# EAGLE design psg-basic (EAGLE 6.6.0)
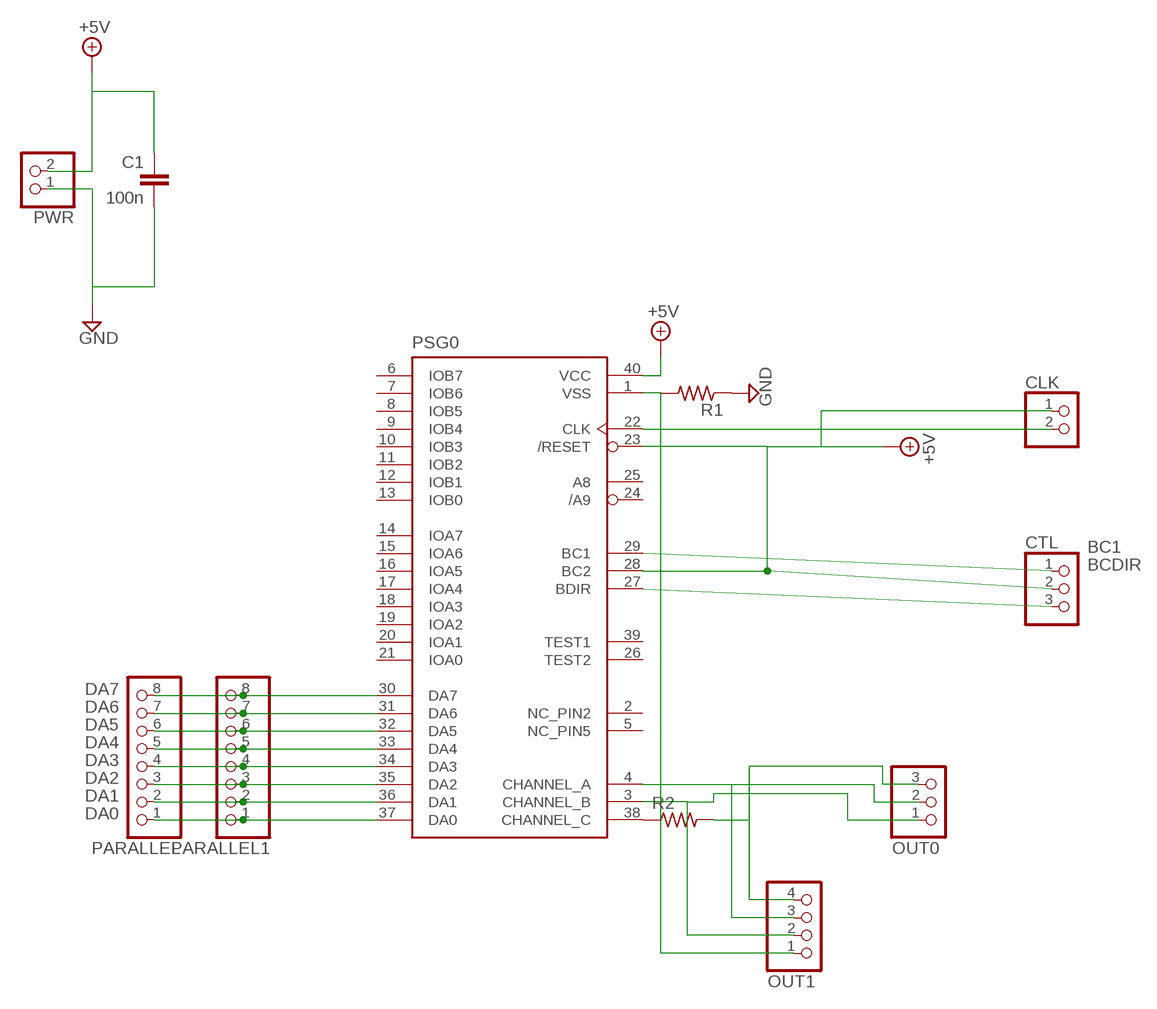
[diagram p0: schematic, sheet 1]

## Parts
C1  100n  050X030_0251  [050X030_025]
CLK  PINHD-1X2  [1X02]
CTL  PINHD-1X3  [1X03]
OUT0  PINHD-1X3  [1X03]
OUT1  PINHD-1X4/90  [1X04/90]
PARALLEL  PINHD-1X8  [1X08]
PARALLEL1  PINHD-1X8  [1X08]
PSG0  AY-3-8910  [DIL40]
PWR  PINHD-1X2  [1X02]
R1  6MM.4.1  [R0207/4A]
R2  6MM.5  [R0207/5]

## Nets
+5V: C1.1 CLK.1 CTL.2 PSG0.23(/RESET) PSG0.28(BC2) PSG0.40(VCC) PWR.2
BC1: CTL.1 PSG0.29(BC1)
BCDIR: CTL.3 PSG0.27(BDIR)
DA0: PARALLEL1.1 PARALLEL.1 PSG0.37(DA0)
DA1: PARALLEL1.2 PARALLEL.2 PSG0.36(DA1)
DA2: PARALLEL1.3 PARALLEL.3 PSG0.35(DA2)
DA3: PARALLEL1.4 PARALLEL.4 PSG0.34(DA3)
DA4: PARALLEL1.5 PARALLEL.5 PSG0.33(DA4)
DA5: PARALLEL1.6 PARALLEL.6 PSG0.32(DA5)
DA6: PARALLEL1.7 PARALLEL.7 PSG0.31(DA6)
DA7: PARALLEL1.8 PARALLEL.8 PSG0.30(DA7)
GND: C1.2 PWR.1 R1.1
N$3: PSG0.38(CHANNEL_C) R2.1
N$4: OUT0.3 OUT1.4 R2.2
N$5: CLK.2 PSG0.22(CLK)
N$6: OUT0.2 OUT1.3 PSG0.4(CHANNEL_A)
N$7: OUT0.1 OUT1.2 PSG0.3(CHANNEL_B)
N$8: OUT1.1 PSG0.1(VSS) R1.2
Unconnected: PSG0.2(NC_PIN2) PSG0.5(NC_PIN5) PSG0.6(IOB7) PSG0.7(IOB6) PSG0.8(IOB5) PSG0.9(IOB4) PSG0.10(IOB3) PSG0.11(IOB2) PSG0.12(IOB1) PSG0.13(IOB0) PSG0.14(IOA7) PSG0.15(IOA6) PSG0.16(IOA5) PSG0.17(IOA4) PSG0.18(IOA3) PSG0.19(IOA2) PSG0.20(IOA1) PSG0.21(IOA0) PSG0.24(/A9) PSG0.25(A8) PSG0.26(TEST2) PSG0.39(TEST1)

## Library data of the parts
C1 = gm-caps-ceramic:050X030_025: 47 - 120pF Xicon Ceramic Disc 2.5mm lead spacing
CLK PWR = pinhead:PINHD-1X2: PIN HEADER
CTL OUT0 = pinhead:PINHD-1X3: PIN HEADER
OUT1 = pinhead:PINHD-1X4: PIN HEADER
PARALLEL PARALLEL1 = pinhead:PINHD-1X8: PIN HEADER
PSG0 = 8Bit_Parts:AY-3-8910
R1 R2 = gm-resistors:6MM: 6mm Resistors Leads spaced 1-6 holes apart for 0.1" perfboard. Suitable for 1/4 watt resistors.

## Board
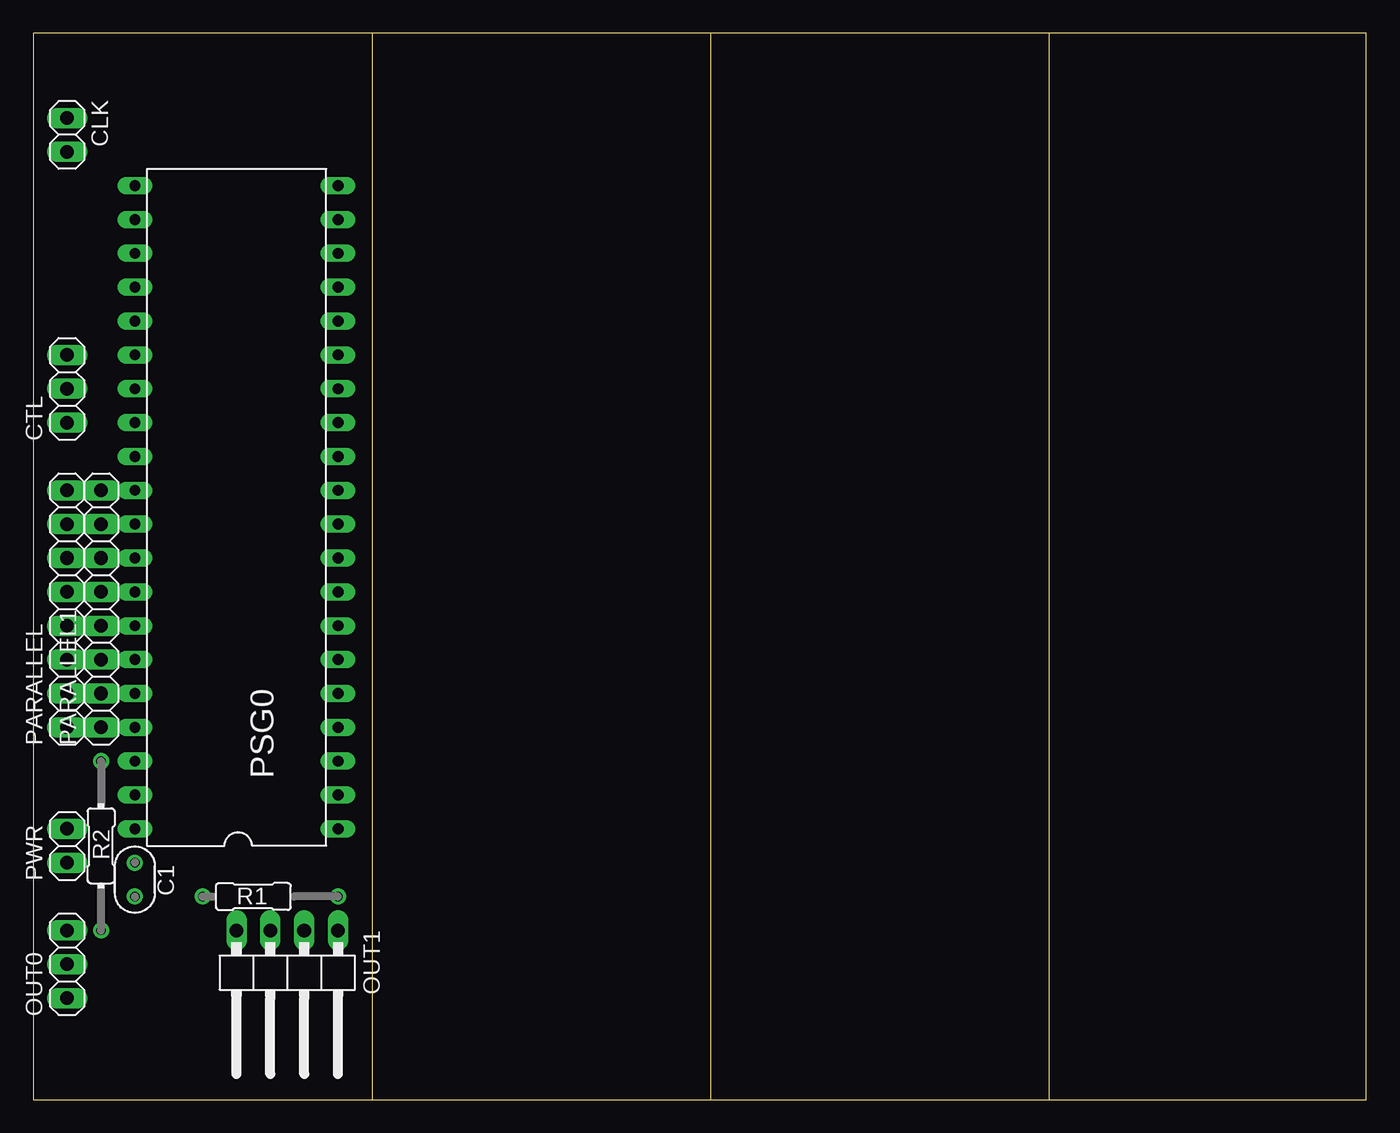
[diagram p1: board, top side]
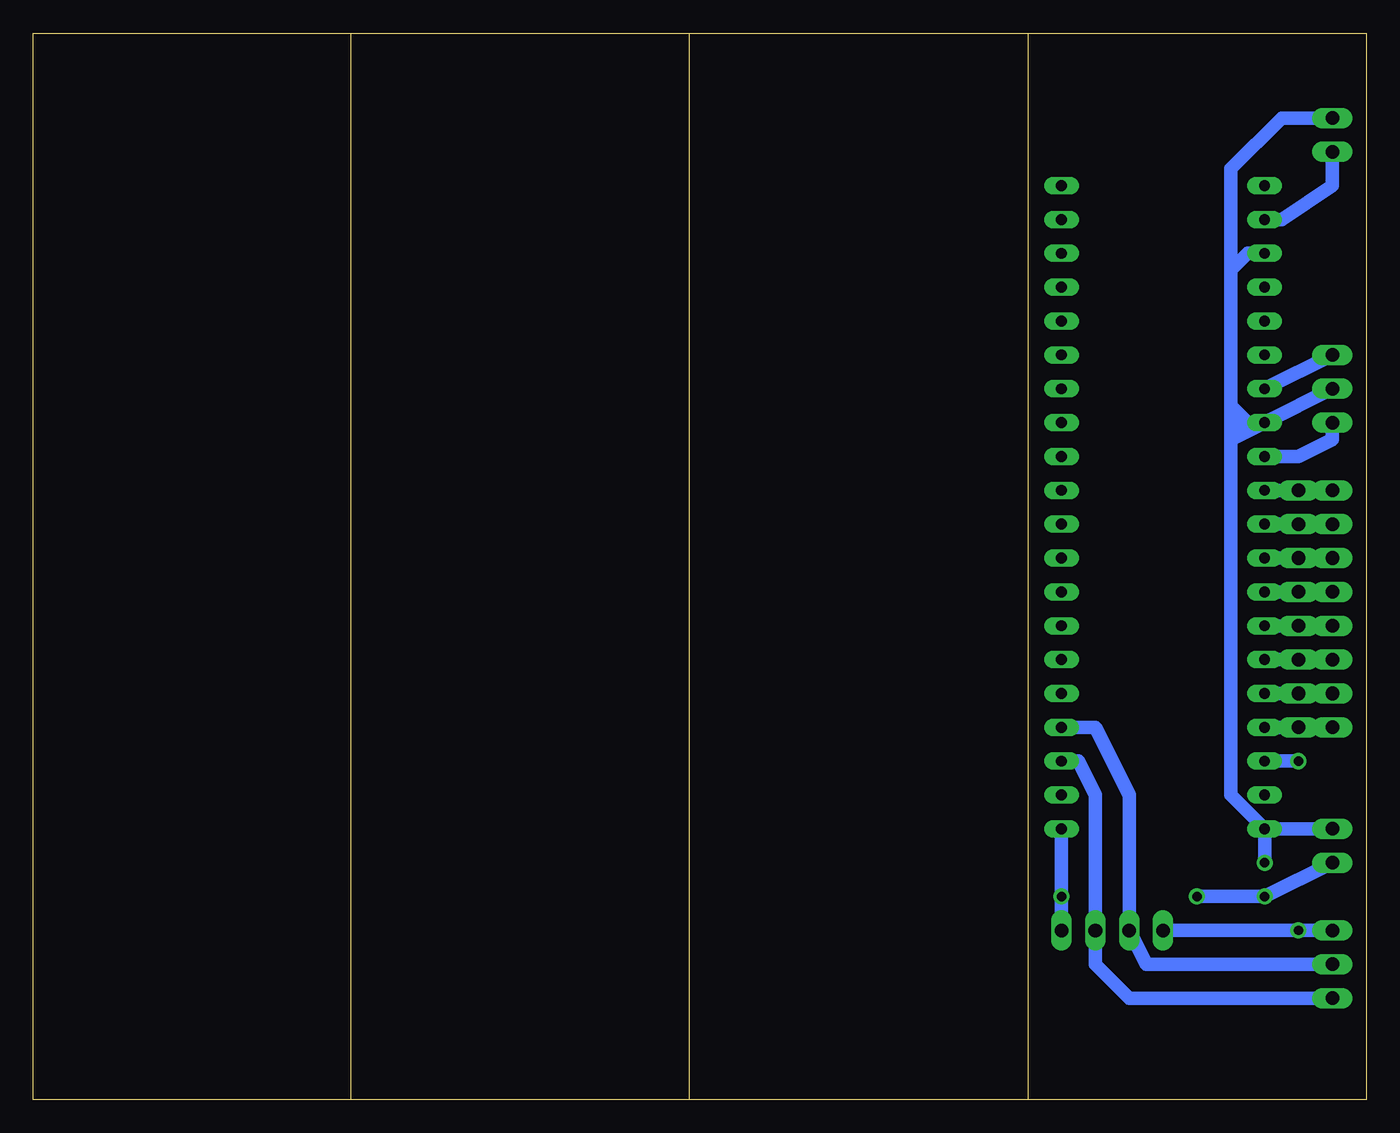
[diagram p2: board, bottom side, seen from below]

Size 100 x 80.01 mm. Coordinates in mm from the lower left corner, seen from the top.
Outline: 25.4,0 0,0 0,80 100,80 100,0 76.2,0
Outline: 25.4,0 50.8,0
Outline: 50.8,0 76.2,0
Outline: 25.4,80.01 25.4,0
Outline: 50.8,80.01 50.8,0
Outline: 76.2,80.01 76.2,0
Copper layers (1*16): Top 0.035mm / dielectric 1.5mm / Bottom 0.035mm
Design rules "default": minimum track width 10mil, minimum drill 24mil, track to track 8mil, track to pad 8mil, pad to pad 8mil, via to via 8mil, smd to smd 8mil, copper to edge 40mil, drill to drill 8mil, minimum pad ring 10mil, minimum via ring 8mil, stop-mask expansion 4mil, vias tented up to drill 0mil, thermal gap 10mil

### Footprints (pad centres in the part's own frame; a part is rotated, then mirrored left to right if it is on the bottom)
050X030_025 = drill 0.7: 1 -1.27,0; 2 1.27,0
1X02 = drill 1.016 long: 1 -1.27,0; 2 1.27,0
1X03 = drill 1.016 long: 1 -2.54,0; 2 0,0; 3 2.54,0
1X04/90 = drill 1.016 long: 1 -3.81,-3.81; 2 -1.27,-3.81; 3 1.27,-3.81; 4 3.81,-3.81
1X08 = drill 1.016 long: 1 -8.89,0; 2 -6.35,0; 3 -3.81,0; 4 -1.27,0; 5 1.27,0; 6 3.81,0; 7 6.35,0; 8 8.89,0
DIL40 = drill 0.813 long: 1 -24.13,-7.62; 2 -21.59,-7.62; 3 -19.05,-7.62; 4 -16.51,-7.62; 5 -13.97,-7.62; 6 -11.43,-7.62; 7 -8.89,-7.62; 8 -6.35,-7.62; 9 -3.81,-7.62; 10 -1.27,-7.62; 11 1.27,-7.62; 12 3.81,-7.62; 13 6.35,-7.62; 14 8.89,-7.62; 15 11.43,-7.62; 16 13.97,-7.62; 17 16.51,-7.62; 18 19.05,-7.62; 19 21.59,-7.62; 20 24.13,-7.62; 21 24.13,7.62; 22 21.59,7.62; 23 19.05,7.62; 24 16.51,7.62; 25 13.97,7.62; 26 11.43,7.62; 27 8.89,7.62; 28 6.35,7.62; 29 3.81,7.62; 30 1.27,7.62; 31 -1.27,7.62; 32 -3.81,7.62; 33 -6.35,7.62; 34 -8.89,7.62; 35 -11.43,7.62; 36 -13.97,7.62; 37 -16.51,7.62; 38 -19.05,7.62; 39 -21.59,7.62; 40 -24.13,7.62
R0207/4A = drill 0.7: 1 -3.81,0; 2 6.35,0
R0207/5 = drill 0.7: 1 -6.35,0; 2 6.35,0

### Placement (x,y rotation side)
C1  7.62,16.51 270 top
CLK  2.54,72.39 270 top
CTL  2.54,53.34 90 top
OUT0  2.54,10.16 90 top
OUT1  19.05,8.89 180 top
PARALLEL  2.54,36.83 90 top
PARALLEL1  5.08,36.83 90 top
PSG0  15.24,44.45 90 top
PWR  2.54,19.05 90 top
R1  16.51,15.24 0 top
R2  5.08,19.05 270 top

### Tracks (layer width: path | path; a pad name or v marks a point on that pad's centre or on a via)
+5V
  Bottom 1.016: 10.16,62.23 10.16,52.07 | 10.16,52.07 8.89,50.8 PSG0.28 | 10.16,52.07 10.16,50.8 | 10.16,49.53 10.16,22.86 PSG0.40 | PWR.2 PSG0.40 | PSG0.40 C1.1 | PSG0.28 10.16,50.8 | 10.16,50.8 10.16,49.53 | 10.16,49.53 PSG0.28 | PSG0.28 CTL.2 | PSG0.23 8.89,63.5 10.16,62.23 | 10.16,62.23 10.16,69.85 6.35,73.66 CLK.1
BC1
  Bottom 1.016: PSG0.29 5.08,48.26 2.54,49.53 CTL.1
BCDIR
  Bottom 1.016: CTL.3 PSG0.27
DA0
  Bottom 1.016: PARALLEL.1 PARALLEL1.1 PSG0.37
DA1
  Bottom 1.016: PARALLEL.2 PARALLEL1.2 PSG0.36
DA2
  Bottom 1.016: PARALLEL.3 PARALLEL1.3 PSG0.35
DA3
  Bottom 1.016: PARALLEL.4 PARALLEL1.4 PSG0.34
DA4
  Bottom 1.016: PARALLEL.5 PARALLEL1.5 PSG0.33
DA5
  Bottom 1.016: PARALLEL.6 PARALLEL1.6 PSG0.32
DA6
  Bottom 1.016: PARALLEL.7 PARALLEL1.7 PSG0.31
DA7
  Bottom 1.016: PARALLEL.8 PARALLEL1.8 PSG0.30
GND
  Bottom 1.016: C1.2 R1.1 | PWR.1 C1.2 | 8.89,15.24 C1.2
N$3
  Bottom 1.016: R2.1 PSG0.38
N$4
  Bottom 1.016: OUT0.3 R2.2 OUT1.4
N$5
  Bottom 1.016: CLK.2 2.54,68.58 6.35,66.04 PSG0.22
N$6
  Bottom 1.016: PSG0.4 20.32,27.94 17.78,22.86 OUT1.3 16.51,10.16 OUT0.2
N$7
  Bottom 1.016: PSG0.3 21.59,25.4 20.32,22.86 OUT1.2 20.32,10.16 17.78,7.62 OUT0.1
N$8
  Bottom 1.016: PSG0.1 R1.2 OUT1.1